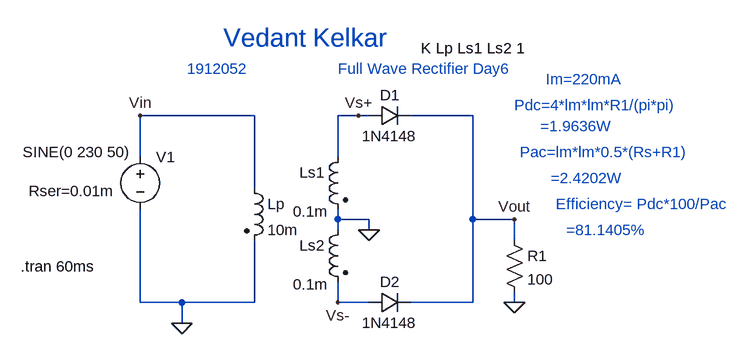
[diagram p0: schematic Draft14.asc]
Draft14.asc, the LTspice schematic file:
Version 4
SHEET 1 1444 680
WIRE 192 80 16 80
WIRE 352 80 320 80
WIRE 368 80 352 80
WIRE 528 80 432 80
WIRE 16 144 16 80
WIRE 320 144 320 80
WIRE 192 192 192 80
WIRE 320 240 320 224
WIRE 368 240 320 240
WIRE 528 240 528 80
WIRE 592 240 528 240
WIRE 320 256 320 240
WIRE 368 256 368 240
WIRE 592 272 592 240
WIRE 16 368 16 224
WIRE 80 368 16 368
WIRE 192 368 192 272
WIRE 192 368 80 368
WIRE 320 368 320 336
WIRE 368 368 320 368
WIRE 528 368 528 240
WIRE 528 368 432 368
WIRE 592 368 592 352
WIRE 80 400 80 368
FLAG 80 400 0
FLAG 16 80 Vin
FLAG 352 80 Vs+
FLAG 592 368 0
FLAG 320 368 Vs-
FLAG 368 256 0
FLAG 592 240 Vout
SYMBOL voltage 16 128 R0
WINDOW 3 -181 8 Left 2
WINDOW 123 0 0 Left 0
WINDOW 39 -172 68 Left 2
SYMATTR Value SINE(0 230 50)
SYMATTR SpiceLine Rser=0.01m
SYMATTR InstName V1
SYMBOL diode 368 96 R270
WINDOW 0 32 32 VTop 2
WINDOW 3 0 32 VBottom 2
SYMATTR InstName D1
SYMATTR Value 1N4148
SYMBOL ind2 336 128 M0
WINDOW 3 31 100 Left 2
SYMATTR Value 0.1m
SYMATTR InstName Ls1
SYMATTR Type ind
SYMBOL ind2 176 176 R0
SYMATTR InstName Lp
SYMATTR Value 10m
SYMATTR Type ind
SYMBOL ind2 336 240 M0
WINDOW 3 31 100 Left 2
SYMATTR Value 0.1m
SYMATTR InstName Ls2
SYMATTR Type ind
SYMBOL diode 368 384 R270
WINDOW 0 32 32 VTop 2
WINDOW 3 0 32 VBottom 2
SYMATTR InstName D2
SYMATTR Value 1N4148
SYMBOL res 576 256 R0
SYMATTR InstName R1
SYMATTR Value 100
TEXT 144 -40 Left 4 ;Vedant Kelkar
TEXT 88 8 Left 2 ;1912052
TEXT 320 8 Left 2 ;Full Wave Rectifier Day6
TEXT -168 312 Left 2 !.tran 60ms
TEXT 448 -24 Left 2 !K Lp Ls1 Ls2 1
TEXT 144 -40 Left 4 ;Vedant Kelkar
TEXT 592 64 Left 2 ;Pdc=4*lm*lm*R1/(pi*pi)
TEXT 600 136 Left 2 ;Pac=lm*lm*0.5*(Rs+R1)
TEXT 656 216 Left 2 ;Efficiency= Pdc*100/Pac
TEXT 632 96 Left 2 ;=1.9636W
TEXT 648 176 Left 2 ;=2.4202W
TEXT 672 256 Left 2 ;=81.1405%
TEXT 640 24 Left 2 ;Im=220mA

The netlist it stands for:
* Draft14.asc
V1 Vin 0 SINE(0 230 50) Rser=0.01m
D1 Vs+ Vout 1N4148
Ls1 Vs+ 0 0.1m
Lp Vin 0 10m
Ls2 0 Vs- 0.1m
D2 Vs- Vout 1N4148
R1 Vout 0 100
.model D D
.lib standard.dio
* Vedant Kelkar
* 1912052
* Full Wave Rectifier Day6
.tran 60ms
K Lp Ls1 Ls2 1
* Vedant Kelkar
* Pdc=4*lm*lm*R1/(pi*pi)
* Pac=lm*lm*0.5*(Rs+R1)
* Efficiency= Pdc*100/Pac
* =1.9636W
* =2.4202W
* =81.1405%
* Im=220mA
.backanno
.end